# Altium schematic sheet Multiplexer_8_to_1.SchDoc
size B; Organization: Altium Limited; Address1: L3, 12a Rodborough Rd; Address2: Frenchs Forest; Address3: NSW; Address4: Australia 2086; SheetNumber: 1; SheetTotal: 1
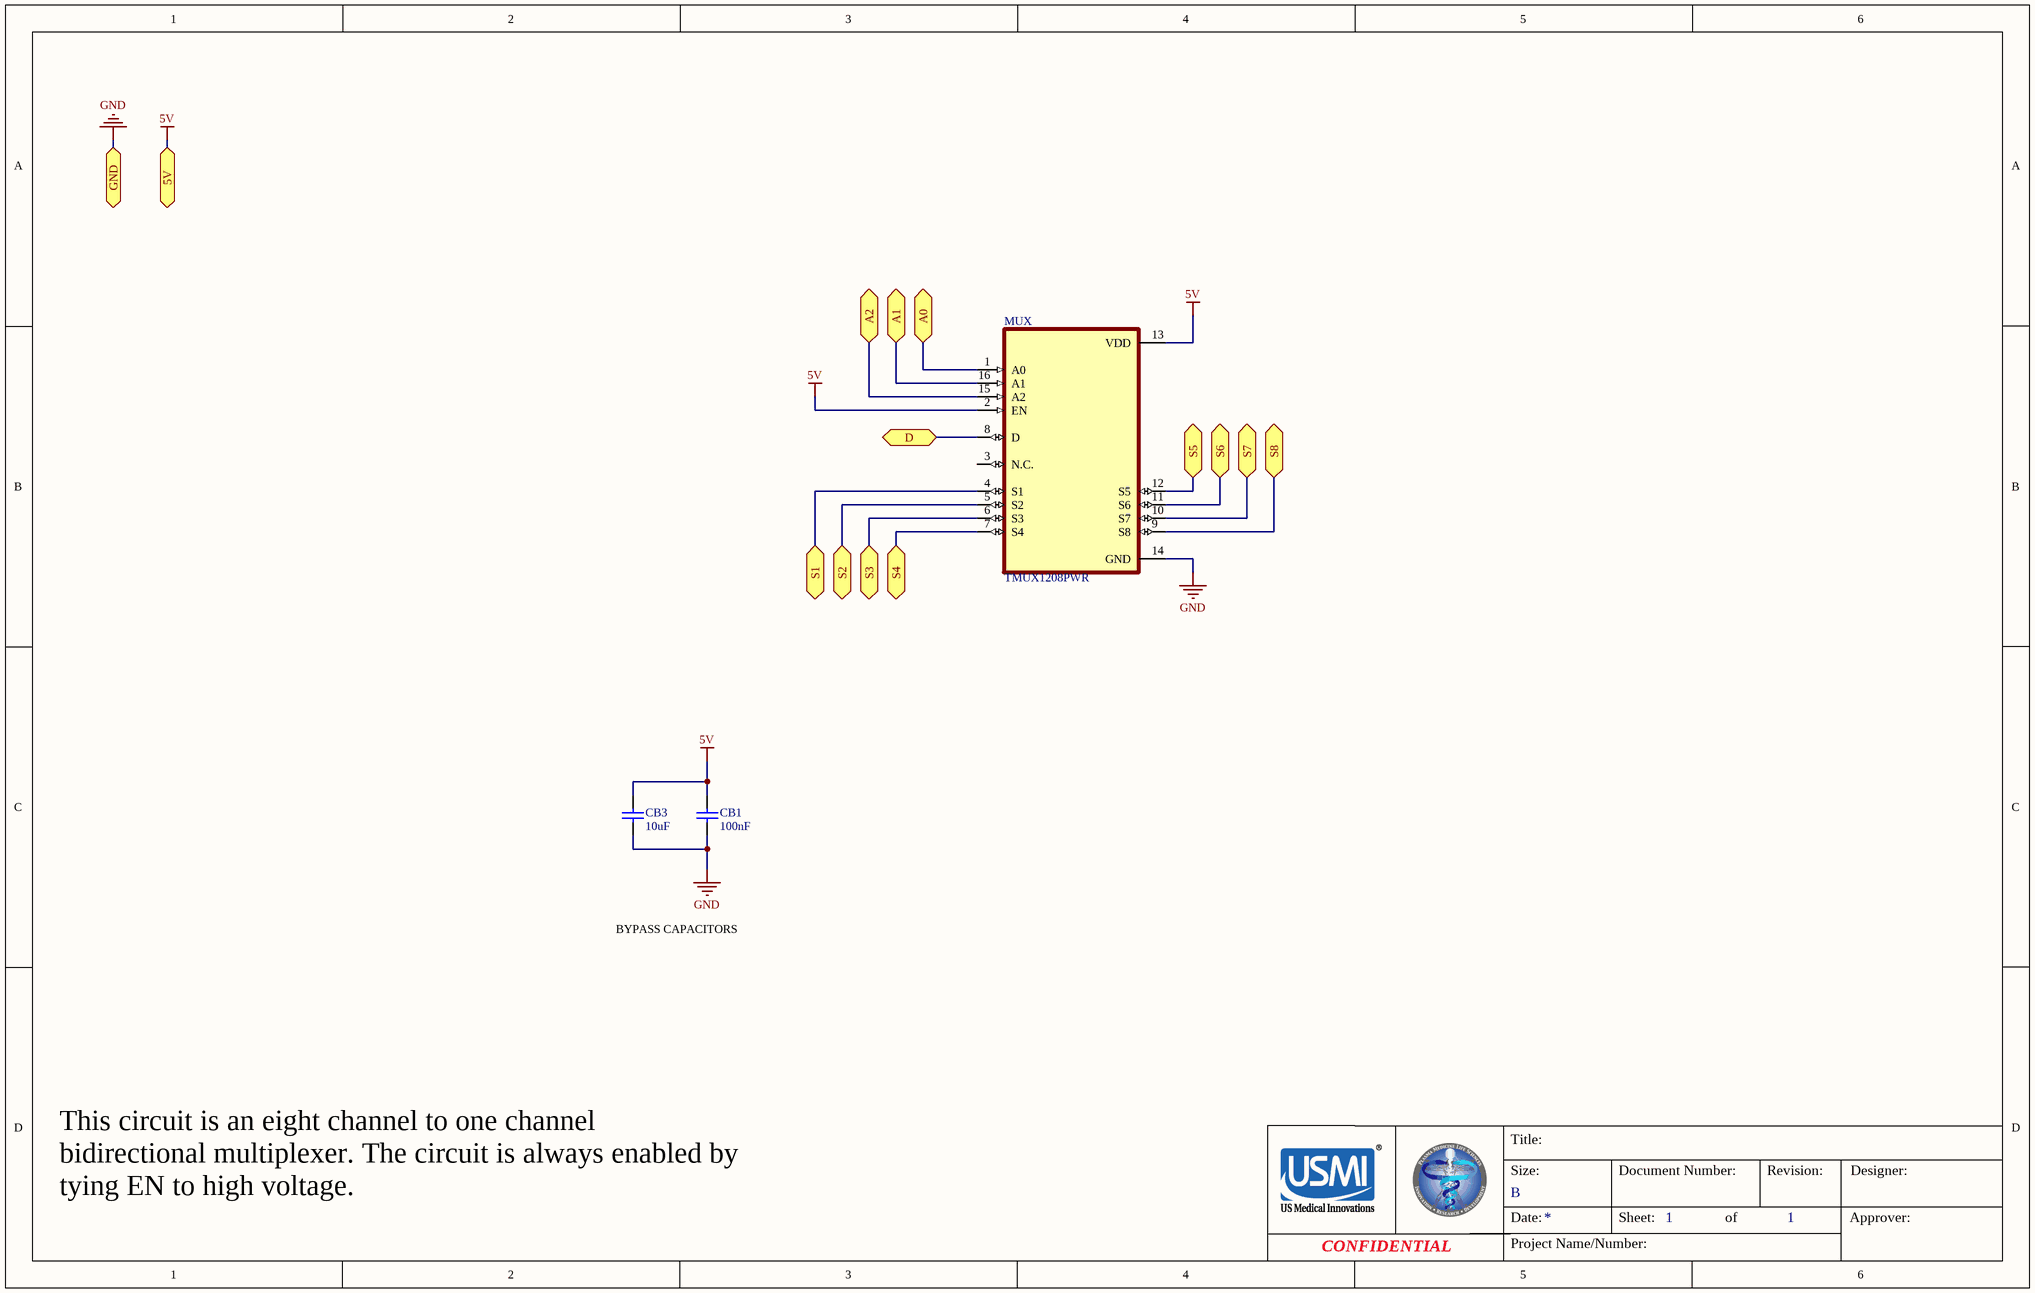
[diagram p0: Multiplexer_8_to_1.SchDoc]

## Parts
CB1  100nF  [0805c]
CB3  10uF  [1206c]
MUX  TMUX1208PWR  [SOP65P640X120-16N]

## Ports
5V, A0, A1, A2, D, GND, S1, S2, S3, S4, S5, S6, S7, S8

## Nets
5V: CB1.2 CB3.2 MUX.2(EN) MUX.13(VDD) ; port 5V
GND: CB1.1 CB3.1 MUX.14(GND) ; port GND
A0: MUX.1(A0) ; port A0
A1: MUX.16(A1) ; port A1
A2: MUX.15(A2) ; port A2
D: MUX.8(D) ; port D
S1: MUX.4(S1) ; port S1
S2: MUX.5(S2) ; port S2
S3: MUX.6(S3) ; port S3
S4: MUX.7(S4) ; port S4
S5: MUX.12(S5) ; port S5
S6: MUX.11(S6) ; port S6
S7: MUX.10(S7) ; port S7
S8: MUX.9(S8) ; port S8

Not connected (* = marked no-connect by the designer): MUX 3(N.C.)

## Notes on the sheet
- BYPASS CAPACITORS
- Title:
- Size:
- Document Number:
- Revision:
- Designer:
- This circuit is an eight channel to one channel bidirectional multiplexer. The circuit is always enabled by tying EN to high voltage.
- Date:
- Project Name/Number:
- B
- Sheet:
- of
- Approver:
- CONFIDENTIAL

## Library data of the parts
CB1 CB3 = Cap: Capacitor; Published: 8-Jun-2000; LatestRevisionDate: 17-Jul-2002; LatestRevisionNote: Re-released for DXP Platform.; PackageReference: RAD-0.3; Publisher: Altium Limited; PackageDescription: Radial Cap, Thru-Hole; 2 Leads; 0.3 in Pin Spacing; Supplier 1: Digi-Key
  CB1: Value: 100nF; Supplier Part Number 1: 490-8049-6-ND
  CB3: Value: 10uF; Supplier Part Number 1: 1276-2876-1-ND
MUX = TMUX1208PWR: 5-V, 8:1, 1-channel general-purpose analog multiplexer with 1.8-V input logic 16-TSSOP -40 to 125; MF: Texas Instruments; Mouser-Purchase-URL: https://snapeda.com/shop?store=Mouser&id=3223186; DigiKey-Purchase-URL: https://snapeda.com/shop?store=DigiKey&id=3223186; SnapEDA_Link: https://www.snapeda.com/parts/TMUX1208PWR/Texas%20Instruments/view-part/3223186/?ref=snap; MP: TMUX1208PWR; Texas_Instruments-Purchase-URL: https://snapeda.com/shop?store=Texas+Instruments&id=3223186; Availability: Warning; Price: None; Value: *; Package: TSSOP-16 Texas Instruments; Check_prices: https://www.snapeda.com/parts/TMUX1208PWR/Texas%20Instruments/view-part/3223186/?ref=eda; Supplier Part Number 1: 296-51847-1-ND; Supplier 1: Digikey